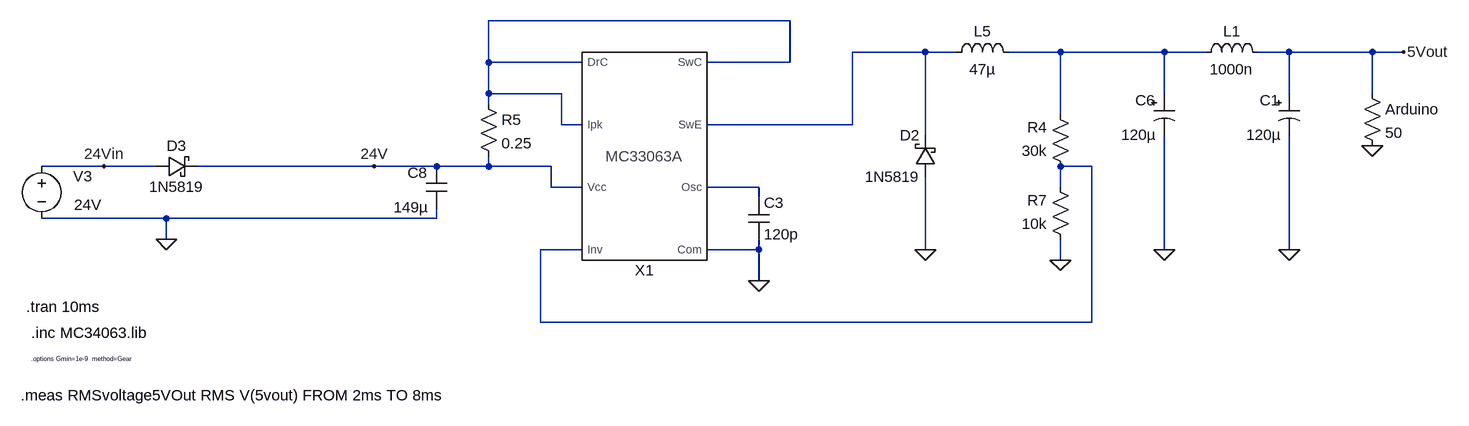
[diagram p0: schematic BuckConverter.asc]
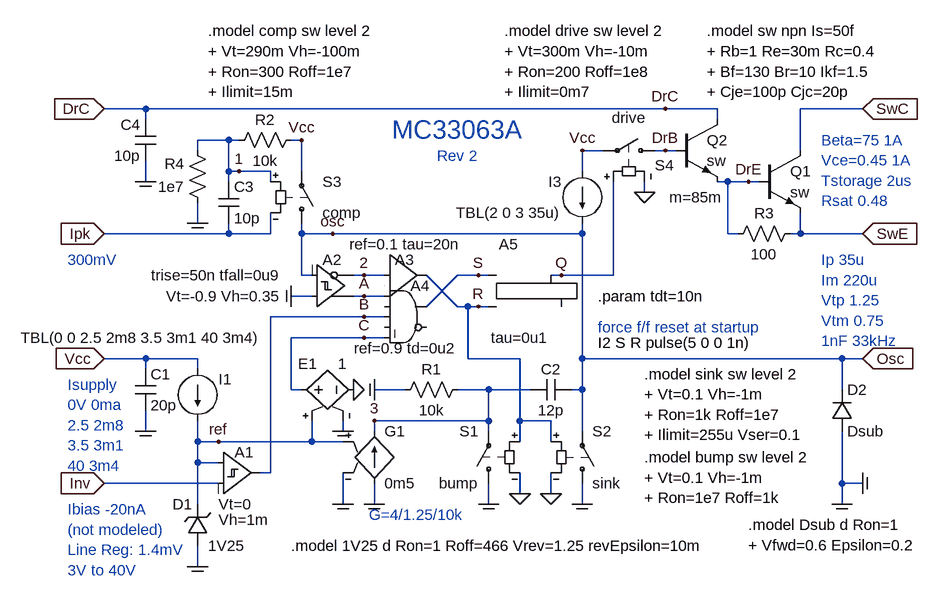
[diagram p1: sub-circuit mc33063a.asc]
BuckConverter.asc, the LTspice schematic file:
Version 4
SHEET 1 1572 680
WIRE 304 -880 -160 -880
WIRE 512 -832 400 -832
WIRE 560 -832 512 -832
WIRE 720 -832 640 -832
WIRE 880 -832 720 -832
WIRE 944 -832 880 -832
WIRE 1072 -832 1024 -832
WIRE 1200 -832 1072 -832
WIRE 1248 -832 1200 -832
WIRE -160 -816 -160 -880
WIRE -16 -816 -160 -816
WIRE 304 -816 304 -880
WIRE 304 -816 176 -816
WIRE -160 -768 -160 -816
WIRE -48 -768 -160 -768
WIRE 880 -768 880 -832
WIRE 1072 -768 1072 -832
WIRE 1200 -768 1200 -832
WIRE -160 -752 -160 -768
WIRE 720 -736 720 -832
WIRE -48 -720 -48 -768
WIRE -16 -720 -48 -720
WIRE 400 -720 400 -832
WIRE 400 -720 176 -720
WIRE 512 -704 512 -832
WIRE -752 -656 -848 -656
WIRE -672 -656 -752 -656
WIRE -336 -656 -608 -656
WIRE -240 -656 -336 -656
WIRE -160 -656 -160 -672
WIRE -160 -656 -240 -656
WIRE -64 -656 -160 -656
WIRE 768 -656 720 -656
WIRE -64 -624 -64 -656
WIRE -16 -624 -64 -624
WIRE 256 -624 176 -624
WIRE 720 -624 720 -656
WIRE 256 -608 256 -624
WIRE -656 -576 -848 -576
WIRE -240 -576 -240 -592
WIRE -240 -576 -656 -576
WIRE -656 -544 -656 -576
WIRE -16 -528 -80 -528
WIRE 256 -528 256 -544
WIRE 256 -528 176 -528
WIRE 512 -528 512 -640
WIRE 880 -528 880 -704
WIRE 1072 -528 1072 -704
WIRE 720 -512 720 -544
WIRE 256 -480 256 -528
WIRE -80 -416 -80 -528
WIRE 768 -416 768 -656
WIRE 768 -416 -80 -416
FLAG -656 -544 0
FLAG 512 -528 0
FLAG -336 -656 24V
FLAG 1200 -688 0
FLAG 256 -480 0
FLAG 720 -512 0
FLAG -752 -656 24Vin
FLAG 880 -528 0
FLAG 1072 -528 0
FLAG 1248 -832 5Vout
SYMBOL polcap 864 -768 R0
WINDOW 0 -29 10 Left 2
WINDOW 3 -50 63 Left 2
SYMATTR InstName C6
SYMATTR Value 120µ
SYMATTR Description Capacitor
SYMATTR Type cap
SYMATTR SpiceLine V=10 Irms=3.87298 Rser=0.018 Lser=0
SYMBOL voltage -848 -672 R0
WINDOW 0 49 31 Left 2
WINDOW 3 50 75 Left 2
WINDOW 123 0 0 Left 2
WINDOW 39 0 0 Left 2
SYMATTR InstName V3
SYMATTR Value 24V
SYMBOL res -176 -768 R0
SYMATTR InstName R5
SYMATTR Value 0.25
SYMBOL schottky 528 -640 R180
WINDOW 0 24 64 Left 2
WINDOW 3 24 0 Left 2
SYMATTR InstName D2
SYMATTR Value 1N5819
SYMATTR Description Zener Diode
SYMATTR Type zener
SYMBOL ind 544 -816 R270
WINDOW 0 32 56 VTop 2
WINDOW 3 5 56 VBottom 2
SYMATTR InstName L5
SYMATTR Value 47µ
SYMBOL cap -256 -656 R0
WINDOW 0 -29 10 Left 2
WINDOW 3 -50 63 Left 2
SYMATTR InstName C8
SYMATTR Value 149µ
SYMBOL schottky -672 -640 R270
WINDOW 0 32 32 VTop 2
WINDOW 3 0 32 VBottom 2
SYMATTR InstName D3
SYMATTR Value 1N5819
SYMATTR Description Zener Diode
SYMATTR Type zener
SYMBOL res 1184 -784 R0
SYMATTR InstName Arduino
SYMATTR Value 50
SYMBOL cap 240 -608 R0
SYMATTR InstName C3
SYMATTR Value 120p
SYMBOL res 736 -640 R180
WINDOW 0 36 76 Left 2
WINDOW 3 36 40 Left 2
SYMATTR InstName R4
SYMATTR Value 30k
SYMBOL res 736 -528 R180
WINDOW 0 36 76 Left 2
WINDOW 3 36 40 Left 2
SYMATTR InstName R7
SYMATTR Value 10k
SYMBOL MC33063A 80 -672 M0
WINDOW 0 0 176 Center 2
SYMATTR InstName X1
SYMBOL ind 928 -816 R270
WINDOW 0 32 56 VTop 2
WINDOW 3 5 56 VBottom 2
SYMATTR InstName L1
SYMATTR Value 1000n
SYMATTR SpiceLine Ipk=0.9 Rser=0.2 Rpar=1600 Cpar=1.25p mfg="Würth Elektronik" pn="74479763210A WE-PMI 0603"
SYMBOL polcap 1056 -768 R0
WINDOW 0 -29 10 Left 2
WINDOW 3 -50 63 Left 2
SYMATTR InstName C1
SYMATTR Value 120µ
SYMATTR Description Capacitor
SYMATTR Type cap
SYMATTR SpiceLine V=10 Irms=3.87298 Rser=0.018 Lser=0
TEXT -872 -440 Left 2 !.tran 10ms
TEXT -864 -400 Left 2 !.inc MC34063.lib
TEXT -864 -360 Left 0 !.options Gmin=1e-9  method=Gear
TEXT -880 -304 Left 2 !.meas RMSvoltage5VOut RMS V(5vout) FROM 2ms TO 8ms

mc33063a.asc, the sub-circuit schematic file:
Version 4
SHEET 1 1352 1072
WIRE -608 -64 -672 -64
WIRE 192 -64 -608 -64
WIRE 272 -64 192 -64
WIRE 496 -64 400 -64
WIRE -608 -48 -608 -64
WIRE 272 -48 272 -64
WIRE -480 -16 -528 -16
WIRE -464 -16 -480 -16
WIRE -368 -16 -384 -16
WIRE -528 0 -528 -16
WIRE 96 0 64 0
WIRE 192 0 176 0
WIRE 208 0 192 0
WIRE 400 0 400 -64
WIRE -480 32 -480 -16
WIRE -464 32 -480 32
WIRE -416 32 -464 32
WIRE -368 32 -368 -16
WIRE 64 32 64 0
WIRE -608 48 -608 16
WIRE -480 48 -480 32
WIRE -416 48 -416 32
WIRE 288 48 272 48
WIRE 320 48 288 48
WIRE 336 48 320 48
WIRE 160 64 160 48
WIRE -528 112 -528 80
WIRE -480 128 -480 112
WIRE -480 128 -672 128
WIRE -416 128 -416 96
WIRE -416 128 -480 128
WIRE -368 128 -368 112
WIRE -320 128 -368 128
WIRE 64 128 64 112
WIRE 64 128 -320 128
WIRE 288 128 288 48
WIRE 304 128 288 128
WIRE 400 128 400 96
WIRE 400 128 384 128
WIRE 496 128 400 128
WIRE -368 192 -368 128
WIRE -352 192 -368 192
WIRE -272 192 -288 192
WIRE -240 192 -272 192
WIRE -96 192 -128 192
WIRE -80 192 -96 192
WIRE 32 192 16 192
WIRE 112 192 112 48
WIRE 112 192 32 192
WIRE -352 224 -384 224
WIRE -272 224 -288 224
WIRE -240 224 -272 224
WIRE -176 240 -128 192
WIRE -128 240 -176 192
WIRE -112 240 -128 240
WIRE -96 240 -112 240
WIRE -80 240 -96 240
WIRE -272 256 -416 256
WIRE -240 256 -272 256
WIRE -272 288 -384 288
WIRE -240 288 -272 288
WIRE -608 320 -672 320
WIRE -528 320 -608 320
WIRE -112 320 -112 240
WIRE -32 320 -112 320
WIRE 64 320 64 128
WIRE 464 320 64 320
WIRE 496 320 464 320
WIRE -608 336 -608 320
WIRE -528 336 -528 320
WIRE -384 368 -384 288
WIRE -368 368 -384 368
WIRE -208 368 -256 368
WIRE -80 368 -128 368
WIRE -16 368 -80 368
WIRE 64 368 64 320
WIRE 64 368 48 368
WIRE 464 368 464 320
WIRE -80 416 -80 368
WIRE -80 416 -256 416
WIRE -32 416 -32 320
WIRE 16 416 -32 416
WIRE -608 432 -608 400
WIRE -304 432 -304 416
WIRE -256 432 -256 416
WIRE -80 432 -80 416
WIRE 64 432 64 368
WIRE -528 448 -528 416
WIRE -496 448 -528 448
WIRE -352 448 -352 416
WIRE -352 448 -496 448
WIRE -304 448 -352 448
WIRE -32 448 -32 416
WIRE 16 448 16 416
WIRE -528 480 -528 448
WIRE -496 480 -528 480
WIRE -416 496 -416 256
WIRE -416 496 -432 496
WIRE -496 512 -672 512
WIRE 464 512 464 432
WIRE 496 512 464 512
WIRE -32 528 -32 496
WIRE 16 528 16 496
WIRE -528 544 -528 480
WIRE -304 544 -304 496
WIRE -256 544 -256 512
WIRE -80 544 -80 512
WIRE 64 544 64 512
WIRE 464 544 464 512
WIRE -528 640 -528 608
FLAG -672 -64 DrC
IOPIN -672 -64 In
FLAG -672 128 Ipk
IOPIN -672 128 In
FLAG -672 320 Vcc
IOPIN -672 320 In
FLAG -672 512 Inv
IOPIN -672 512 In
FLAG 496 -64 SwC
IOPIN 496 -64 In
FLAG 496 128 SwE
IOPIN 496 128 In
FLAG 496 320 Osc
IOPIN 496 320 In
FLAG 496 512 Com
IOPIN 496 512 In
FLAG 464 544 COM
FLAG -528 640 COM
FLAG 64 0 Vcc
FLAG 64 544 COM
FLAG -368 -16 Vcc
FLAG 160 64 0
FLAG -464 32 1
FLAG -272 224 A
FLAG -272 256 B
FLAG -96 192 S
FLAG -96 240 R
FLAG 32 192 Q
FLAG 320 48 DrE
FLAG -272 192 2
FLAG -608 48 COM
FLAG -384 224 COM
FLAG -608 432 COM
FLAG 16 528 0
FLAG -32 528 0
FLAG -80 544 COM
FLAG -256 544 COM
FLAG -256 368 COM
FLAG -304 544 COM
FLAG -496 448 ref
FLAG -256 416 3
FLAG -320 128 osc
FLAG -272 288 C
FLAG 192 -64 DrC
FLAG -528 112 COM
FLAG 192 0 DrB
FLAG -288 368 0
FLAG -304 432 COM
SYMBOL cap -624 336 R0
SYMATTR InstName C1
SYMATTR Value 20p
SYMBOL current -528 336 M0
WINDOW 123 0 0 Left 2
WINDOW 39 0 0 Left 2
WINDOW 3 -99 -48 Left 2
WINDOW 0 -32 16 Right 2
SYMATTR Value TBL(0 0 2.5 2m8 3.5 3m1 40 3m4)
SYMATTR InstName I1
SYMBOL zener -512 608 R180
WINDOW 0 24 64 Left 2
WINDOW 3 0 0 Right 2
SYMATTR InstName D1
SYMATTR Value 1V25
SYMBOL Digital\\diffschmtbuf -496 432 R0
WINDOW 3 0 112 Left 2
WINDOW 0 25 32 Left 2
WINDOW 123 0 136 Left 2
SYMATTR Value Vt=0
SYMATTR InstName A1
SYMATTR Value2 Vh=1m
SYMATTR SpiceLine tripdt={tdt}
SYMBOL Digital\\diffschmitt -352 272 M180
WINDOW 3 -48 48 Right 2
WINDOW 0 16 104 Left 2
WINDOW 123 -48 80 Right 2
SYMATTR Value Vt=-0.9 Vh=0.35
SYMATTR InstName A2
SYMATTR Value2 trise=50n tfall=0u9
SYMATTR SpiceLine tripdt={tdt}
SYMBOL Digital\\buf1 -240 128 R0
WINDOW 0 16 40 Left 2
WINDOW 3 32 16 Center 2
SYMATTR InstName A3
SYMATTR Value ref=0.1 tau=20n
SYMATTR Value2 tripdt={tdt}
SYMBOL Digital\\and -208 192 R0
WINDOW 3 0 112 Center 2
SYMATTR Value ref=0.9 td=0u2
SYMATTR InstName A4
SYMATTR Value2 tripdt={tdt}
SYMBOL Digital\\srflop -32 144 R0
WINDOW 3 0 144 Center 2
WINDOW 0 -32 0 Left 2
SYMATTR Value tau=0u1
SYMATTR InstName A5
SYMATTR Value2 tripdt={tdt}
SYMBOL g -256 416 R0
WINDOW 0 16 16 Left 2
WINDOW 3 16 96 Left 2
SYMATTR InstName G1
SYMATTR Value 0m5
SYMBOL res -224 384 R270
WINDOW 0 32 56 VTop 2
WINDOW 3 0 56 VBottom 2
SYMATTR InstName R1
SYMATTR Value 10k
SYMBOL cap 48 352 R90
WINDOW 0 0 32 VBottom 2
WINDOW 3 32 32 VTop 2
SYMATTR InstName C2
SYMATTR Value 12p
SYMBOL sw -80 528 R180
WINDOW 0 16 96 Left 2
WINDOW 3 16 16 Left 2
SYMATTR InstName S1
SYMATTR Value bump
SYMBOL sw 64 528 M180
WINDOW 0 16 96 Left 2
WINDOW 3 16 16 Left 2
SYMATTR InstName S2
SYMATTR Value sink
SYMBOL current 64 32 M0
WINDOW 0 32 16 Left 2
WINDOW 3 32 64 Left 2
SYMATTR InstName I3
SYMATTR Value TBL(2 0 3 35u)
SYMBOL res -480 0 R270
WINDOW 0 32 56 VTop 2
WINDOW 3 0 56 VBottom 2
SYMATTR InstName R2
SYMATTR Value 10k
SYMBOL cap -496 48 R0
SYMATTR InstName C3
SYMATTR Value 10p
SYMBOL sw -368 128 M180
WINDOW 0 32 80 Left 2
WINDOW 3 32 32 Left 2
SYMATTR InstName S3
SYMATTR Value comp
SYMBOL cap -592 -48 M0
SYMATTR InstName C4
SYMATTR Value 10p
SYMBOL sw 192 0 M270
WINDOW 0 -23 16 VLeft 2
WINDOW 3 35 56 VTop 2
SYMATTR InstName S4
SYMATTR Value drive
SYMBOL res 288 144 R270
WINDOW 0 32 56 VTop 2
WINDOW 3 0 56 VBottom 2
SYMATTR InstName R3
SYMATTR Value 100
SYMBOL npn 336 0 R0
WINDOW 0 48 32 Left 2
WINDOW 3 48 64 Left 2
SYMATTR InstName Q1
SYMATTR Value sw
SYMBOL diode 448 432 M180
WINDOW 0 24 64 Left 2
WINDOW 3 24 0 Left 2
SYMATTR InstName D2
SYMATTR Value Dsub
SYMBOL res -512 96 R180
WINDOW 0 36 76 Left 2
WINDOW 3 36 40 Left 2
SYMATTR InstName R4
SYMATTR Value 1e7
SYMBOL npn 208 -48 R0
WINDOW 0 48 32 Left 2
WINDOW 3 48 64 Left 2
WINDOW 123 72 120 Right 2
SYMATTR InstName Q2
SYMATTR Value sw
SYMATTR Value2 m=85m
SYMBOL e -384 368 R270
WINDOW 0 40 40 VLeft 2
WINDOW 3 40 72 VRight 2
SYMATTR InstName E1
SYMATTR Value 1
TEXT -512 -184 Left 2 !.model comp sw level 2\n+ Vt=290m Vh=-100m\n+ Ron=300 Roff=1e7\n+ Ilimit=15m
TEXT 160 344 Left 2 !.model sink sw level 2\n+ Vt=0.1 Vh=-1m\n+ Ron=1k Roff=1e7\n+ Ilimit=255u Vser=0.1
TEXT 160 472 Left 2 !.model bump sw level 2\n+ Vt=0.1 Vh=-1m\n+ Ron=1e7 Roff=1k
TEXT -384 608 Left 2 !.model 1V25 d Ron=1 Roff=466 Vrev=1.25 revEpsilon=10m
TEXT -128 -32 Center 4 ;MC33063A
TEXT -728 168 Left 2 ;300mV
TEXT -728 360 Left 2 ;Isupply\n0V 0ma\n2.5 2m8\n3.5 3m1\n40 3m4
TEXT -728 552 Left 2 ;Ibias -20nA\n(not modeled)\nLine Reg: 1.4mV\n3V to 40V
TEXT 432 -16 Left 2 ;Beta=75 1A\nVce=0.45 1A\nTstorage 2us\nRsat 0.48
TEXT 432 168 Left 2 ;Ip 35u\nIm 220u\nVtp 1.25\nVtm 0.75\n1nF 33kHz
TEXT 88 224 Left 2 !.param tdt=10n
TEXT 88 296 Left 2 !I2 S R pulse(5 0 0 1n)
TEXT -264 560 Left 2 ;G=4/1.25/10k
TEXT 88 272 Left 2 ;force f/f reset at startup
TEXT 320 576 Left 2 !.model Dsub d Ron=1\n+ Vfwd=0.6 Epsilon=0.2
TEXT 256 -184 Left 2 !.model sw npn Is=50f\n+ Rb=1 Re=30m Rc=0.4\n+ Bf=130 Br=10 Ikf=1.5\n+ Cje=100p Cjc=20p
TEXT -56 -184 Left 2 !.model drive sw level 2\n+ Vt=300m Vh=-10m\n+ Ron=200 Roff=1e8\n+ Ilimit=0m7
TEXT -128 8 Center 2 ;Rev 2

The netlist it stands for:
* BuckConverter.asc
C6 N003 0 120µ V=10 Irms=3.87298 Rser=0.018 Lser=0
V3 24Vin 0 24V
R5 N001 24V 0.25
D2 0 N002 1N5819
L5 N002 N003 47µ
C8 24V 0 149µ
D3 24Vin 24V 1N5819
R§Arduino 5Vout 0 50
C3 N005 0 120p
R4 N004 N003 30k
R7 0 N004 10k
XX1 N001 N002 N005 0 N004 24V N001 N001 mc33063a
L1 N003 5Vout 1000n Ipk=0.9 Rser=0.2 Rpar=1600 Cpar=1.25p mfg="Würth Elektronik" pn="74479763210A WE-PMI 0603"
C1 5Vout 0 120µ V=10 Irms=3.87298 Rser=0.018 Lser=0

* block symbol definitions
.subckt mc33063a SwC SwE Osc Com Inv Vcc Ipk DrC
C1 Vcc Com 20p
I1 Vcc ref TBL(0 0 2.5 2m8 3.5 3m1 40 3m4)
D1 Com ref 1V25
A1 ref Inv 0 0 0 0 B 0 SCHMITT Vt=0 Vh=1m tripdt={tdt}
A2 Com Osc 0 0 0 2 A 0 SCHMITT Vt=-0.9 Vh=0.35 trise=50n tfall=0u9 tripdt={tdt}
A3 2 0 0 0 0 0 R 0 BUF ref=0.1 tau=20n tripdt={tdt}
A4 A 0 B 0 C 0 S 0 AND ref=0.9 td=0u2 tripdt={tdt}
A5 S R 0 0 0 0 Q 0 SRFLOP tau=0u1 tripdt={tdt}
G1 Com 3 ref Com 0m5
R1 Com 3 10k
C2 Osc 3 12p
S1 Com 3 R 0 bump
S2 Com Osc R 0 sink
I3 Vcc Osc TBL(2 0 3 35u)
R2 1 Vcc 10k
C3 1 Ipk 10p
S3 Osc Vcc 1 Ipk comp
C4 DrC Com 10p
S4 DrB Vcc Q 0 drive
R3 DrE SwE 100
Q1 SwC DrE SwE 0 sw
D2 Com Osc Dsub
R4 Com 1 1e7
Q2 DrC DrB DrE 0 sw m=85m
E1 C 0 ref Com 1
.model comp sw level 2
+ Vt=290m Vh=-100m
+ Ron=300 Roff=1e7
+ Ilimit=15m
.model sink sw level 2
+ Vt=0.1 Vh=-1m
+ Ron=1k Roff=1e7
+ Ilimit=255u Vser=0.1
.model bump sw level 2
+ Vt=0.1 Vh=-1m
+ Ron=1e7 Roff=1k
.model 1V25 d Ron=1 Roff=466 Vrev=1.25 revEpsilon=10m
* MC33063A
* 300mV
* Isupply
* 0V 0ma
* 2.5 2m8
* 3.5 3m1
* 40 3m4
* Ibias -20nA
* (not modeled)
* Line Reg: 1.4mV
* 3V to 40V
* Beta=75 1A
* Vce=0.45 1A
* Tstorage 2us
* Rsat 0.48
* Ip 35u
* Im 220u
* Vtp 1.25
* Vtm 0.75
* 1nF 33kHz
.param tdt=10n
I2 S R pulse(5 0 0 1n)
* G=4/1.25/10k
* force f/f reset at startup
.model Dsub d Ron=1
+ Vfwd=0.6 Epsilon=0.2
.model sw npn Is=50f
+ Rb=1 Re=30m Rc=0.4
+ Bf=130 Br=10 Ikf=1.5
+ Cje=100p Cjc=20p
.model drive sw level 2
+ Vt=300m Vh=-10m
+ Ron=200 Roff=1e8
+ Ilimit=0m7
* Rev 2
.ends mc33063a

.model D D
.lib standard.dio
.model NPN NPN
.model PNP PNP
.lib standard.bjt
.tran 10ms
.inc MC34063.lib
.options Gmin=1e-9  method=Gear
.meas RMSvoltage5VOut RMS V(5vout) FROM 2ms TO 8ms
.backanno
.end